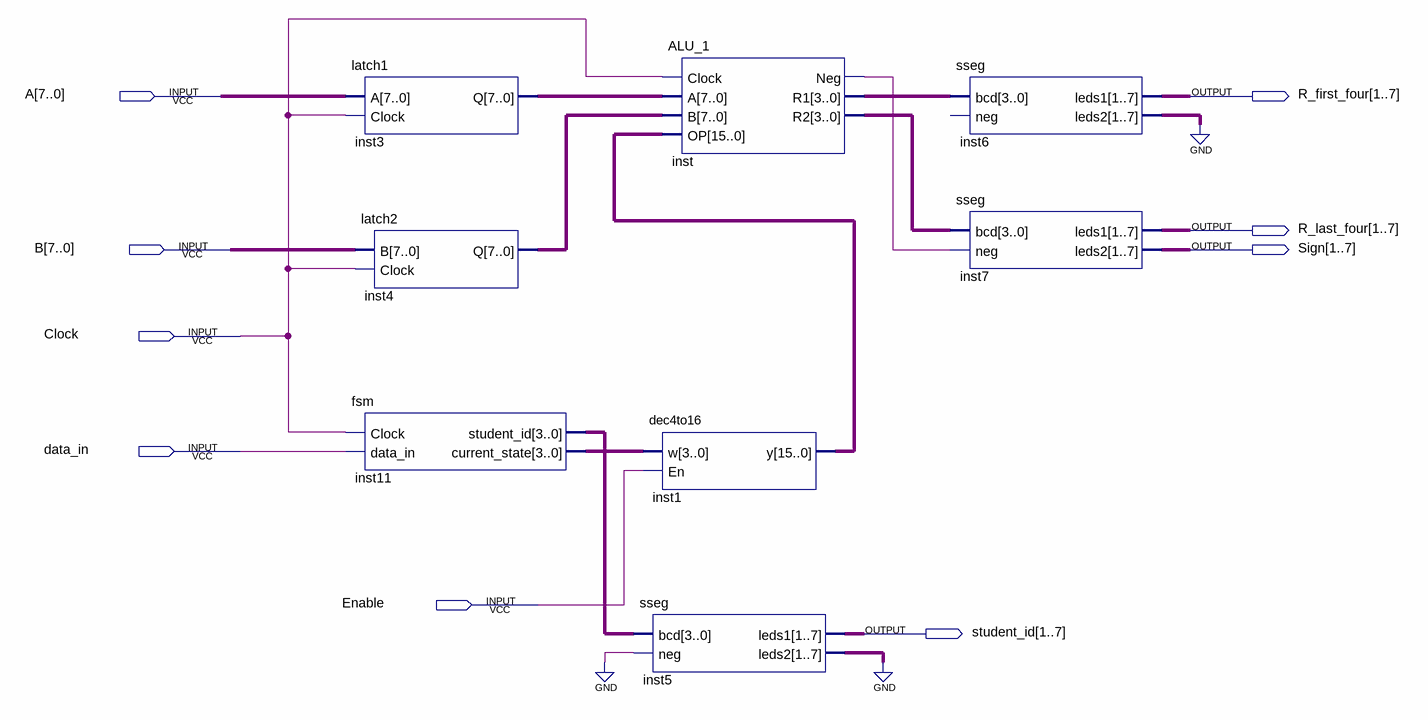
[diagram p0: schematic sheet]
// Quartus schematic ALU1_BlockDiagram.bdf as structural Verilog: 8 symbols, 9 pins
module ALU1_BlockDiagram (
  input  [7:0] A,
  input  [7:0] B,
  input  Clock,
  input  data_in,
  input  Enable,
  output [1:7] R_first_four,
  output [1:7] R_last_four,
  output [1:7] Sign,
  output [1:7] student_id
);

  wire inst_neg;
  wire [3:0] inst11_current_state, inst11_student_id, inst_r1, inst_r2;
  wire [6:0] inst5_leds2, inst6_leds2;
  wire [7:0] inst3_q, inst4_q;
  wire [15:0] inst1_y;

  latch1 inst3 (.A(A), .Clock(Clock), .Q(inst3_q));
  latch2 inst4 (.B(B), .Clock(Clock), .Q(inst4_q));
  fsm inst11 (.Clock(Clock), .data_in(data_in), .student_id(inst11_student_id), .current_state(inst11_current_state));
  ALU_1 inst (.Clock(Clock), .A(inst3_q), .B(inst4_q), .OP(inst1_y), .Neg(inst_neg), .R1(inst_r1), .R2(inst_r2));
  dec4to16 inst1 (.w(inst11_current_state), .En(Enable), .y(inst1_y));
  sseg inst5 (.bcd(inst11_student_id), .neg(1'b0), .leds1(student_id), .leds2(inst5_leds2));
  sseg inst6 (.bcd(inst_r1), .leds1(R_first_four), .leds2(inst6_leds2));  // open: neg
  sseg inst7 (.bcd(inst_r2), .neg(inst_neg), .leds1(R_last_four), .leds2(Sign));
  // also tied to GND on the sheet: {inst6_leds2[0], inst6_leds2[1], inst6_leds2[2], inst6_leds2[3], inst6_leds2[4], inst6_leds2[5], inst6_leds2[6], inst5_leds2[0], inst5_leds2[1], inst5_leds2[2], inst5_leds2[3], inst5_leds2[4], inst5_leds2[5], inst5_leds2[6]}
endmodule
